# Altium schematic sheet SIM_CARD.SchDoc
size A; SheetNumber: 8; SheetTotal: 13
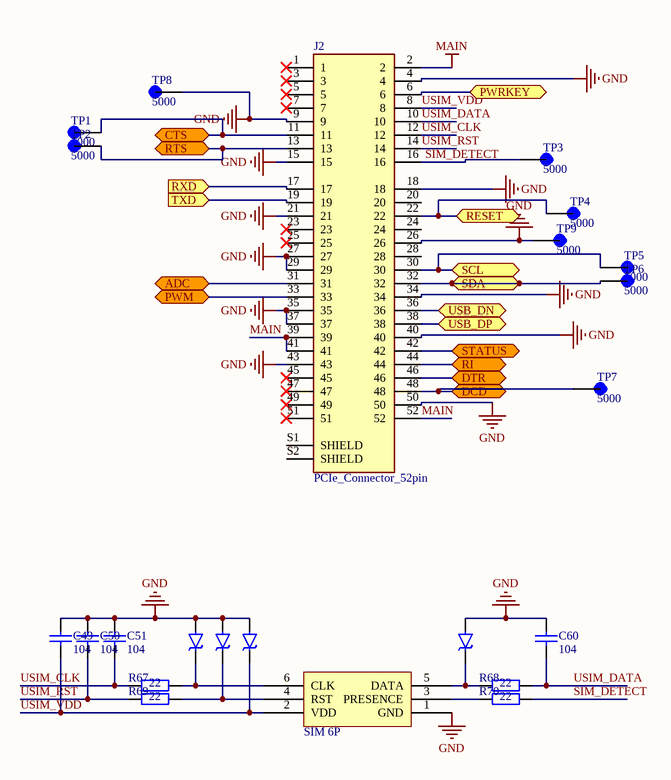
[diagram p0: SIM_CARD.SchDoc]

## Parts
C49  104  [tu 0603]
C50  104  [tu 0603]
C51  104  [tu 0603]
C60  104  [tu 0603]
J2  PCIe_Connector_52pin  [MOLEX_67910-0002]
R67  22  [tro smd 0603]
R68  22  [tro smd 0603]
R69  22  [tro smd 0603]
R70  22  [tro smd 0603]
SIM1  SIM 6P  [sim6]
TP1  5000  [KEYSTONE_5000]
TP2  5000  [KEYSTONE_5000]
TP3  5000  [KEYSTONE_5000]
TP4  5000  [KEYSTONE_5000]
TP5  5000  [KEYSTONE_5000]
TP6  5000  [KEYSTONE_5000]
TP7  5000  [KEYSTONE_5000]
TP8  5000  [KEYSTONE_5000]
TP9  5000  [KEYSTONE_5000]
TVS1  TVS Diode  [SMA - DO-214AC]  (value not drawn)
TVS2  TVS Diode  [SMA - DO-214AC]  (value not drawn)
TVS3  TVS Diode  [SMA - DO-214AC]  (value not drawn)
TVS4  TVS Diode  [SMA - DO-214AC]  (value not drawn)

## Ports
ADC (bidir), CTS (bidir), DCD (bidir), DTR (bidir), PWM (bidir), PWRKEY (bidir), RESET (bidir), RI (bidir), RTS (bidir), RXD (in), SCL (bidir), SDA (bidir), STATUS (bidir), TXD (in), USB_DN (bidir), USB_DP (bidir)

## Nets
GND: C49.1 C50.1 C51.1 C60.1 J2.4 J2.9 J2.15 J2.18 J2.21 J2.26 J2.27 J2.29 J2.34 J2.35 J2.37 J2.40 J2.43 J2.50 SIM1.1(GND) TP8.TP TP9.TP TVS1.2 TVS2.2 TVS3.2 TVS4.2
MAIN: J2.2 J2.39 J2.41 J2.52
ADC: J2.31 ; port ADC
CTS: J2.11 TP1.TP ; port CTS
DCD: J2.48 TP7.TP ; port DCD
DTR: J2.46 ; port DTR
PWM: J2.33 ; port PWM
PWRKEY: J2.6 ; port PWRKEY
RESET: J2.22 TP4.TP ; port RESET
RI: J2.44 ; port RI
RTS: J2.13 TP2.TP ; port RTS
RXD: J2.17 ; port RXD
SCL: J2.30 TP5.TP ; port SCL
SDA: J2.32 TP6.TP ; port SDA
SIM_DETECT: J2.16 R70.1 TP3.TP
STATUS: J2.42 ; port STATUS
TXD: J2.19 ; port TXD
USB_DN: J2.36 ; port USB_DN
USB_DP: J2.38 ; port USB_DP
USIM_CLK: C51.2 J2.12 R67.2
USIM_DATA: C60.2 J2.10 R68.1
USIM_RST: C50.2 J2.14 R69.2
USIM_VDD: C49.2 J2.8 SIM1.2(VDD) TVS3.1
NetR67_1: R67.1 SIM1.6(CLK) TVS1.1
NetR68_2: R68.2 SIM1.5(DATA) TVS4.1
NetR69_1: R69.1 SIM1.4(RST) TVS2.1
NetR70_2: R70.2 SIM1.3(PRESENCE)

Not connected (* = marked no-connect by the designer): J2 1* 3* 5* 7* 20 23* 24 25* 28 45* 47* 49* 51* S1(SHIELD) S2(SHIELD)

## Library data of the parts
C49-C51 C60 = Tu 0603 104 50V 10%: Dán; Don_Vi: Con; So_Chan: 2; Ten_Linh_Kien: Tụ 0603 104-100nF 10% 50V; Ma_Hang: MH004568; Chung_Loai: Dán; Kieu_Chan: *
J2 = PCIe_Connector_52pin: 52 Position Female Connector PCI Express Mini Card Gold 0.031 _0.80mm_ Black; MF: Molex; MP: 67910-0002; SnapEDA_Link: https://www.snapeda.com/parts/67910-0002/Molex/view-part/423219/?ref=snap; Availability: Unavailable; Package: None; Value: *; Price: None
R67-R70 = Tro 0603 5% 3.3k: Dán; Don_Vi: Con; So_Chan: 2; Ten_Linh_Kien: Trở 0603 5% 3.3k; Ma_Hang: MH006332; Chung_Loai: Dán; Kieu_Chan: *
SIM1 = Khay SIM 6P
TP1-TP9 = 5000: PC Test Point - Miniature; MF: Keystone Electronics; Purchase-URL: https://pricing.snapeda.com/search/part/5000/?ref=eda; Check_prices: https://www.snapeda.com/parts/5000/Keystone+Electronics/view-part/?ref=eda; Value: *; Price: None; Availability: In Stock; Package: Test Point Keystone Electronics; MP: 5000; SnapEDA_Link: https://www.snapeda.com/parts/5000/Keystone+Electronics/view-part/?ref=snap
TVS1-TVS4 = TVS Uni Diode